# Altium project BSc_PCB_balanserande_pinne.PrjPcb
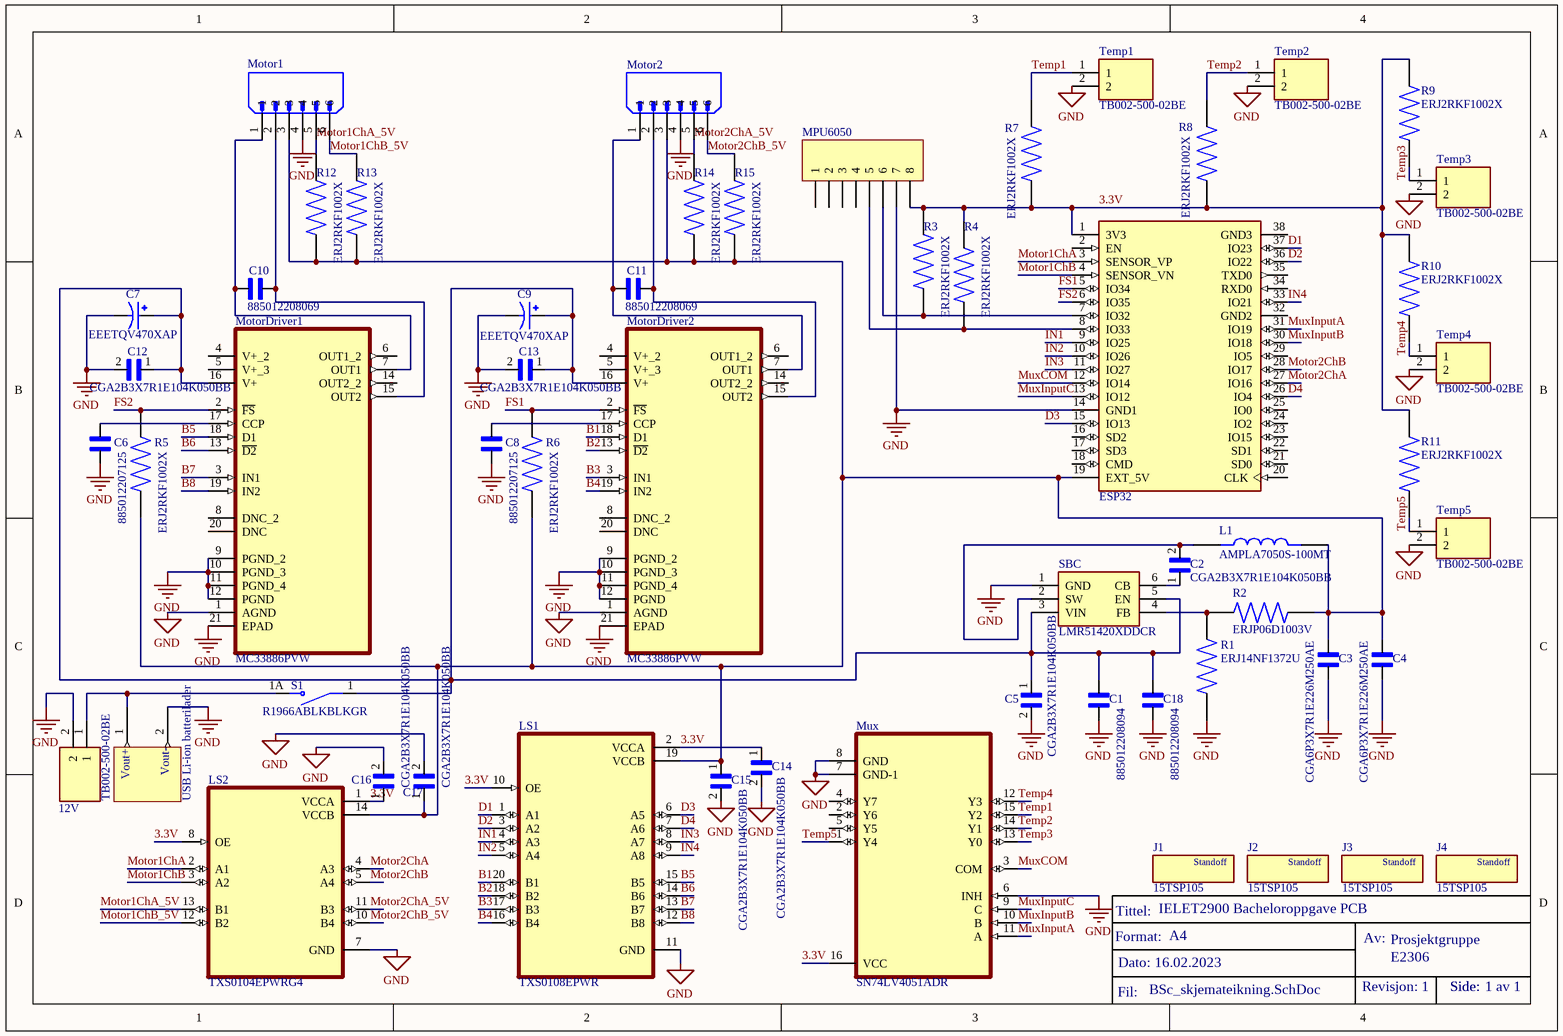
[diagram p0: BSc_skjemateikning.SchDoc]
1 sheet, 56 parts. Net scope: global (net labels, ports and power ports of the same name join across sheets).
Board file: BSc_PCB_teikning.PcbDoc

## Sheet BSc_skjemateikning.SchDoc
size A4; SheetNumber: 1; SheetTotal: 1

### Parts
12V  TB002-500-02BE  [CUI_TB002-500-02BE]
C1  885012208094  [WCAP-CSGP_885012208094]
C2  CGA2B3X7R1E104K050BB  [CAPC1005X55N]
C3  CGA6P3X7R1E226M250AE  [CAP_CGA6P3X7R1E226M250AE]
C4  CGA6P3X7R1E226M250AE  [CAP_CGA6P3X7R1E226M250AE]
C5  CGA2B3X7R1E104K050BB  [CAPC1005X55N]
C6  885012207125  [WCAP-CSGP_885012207125]
C7  EEETQV470XAP  [CAP_EEETQV470XAP]
C8  885012207125  [WCAP-CSGP_885012207125]
C9  EEETQV470XAP  [CAP_EEETQV470XAP]
C10  885012208069  [WCAP-CSGP_885012208069]
C11  885012208069  [WCAP-CSGP_885012208069]
C12  CGA2B3X7R1E104K050BB  [CAPC1005X55N]
C13  CGA2B3X7R1E104K050BB  [CAPC1005X55N]
C14  CGA2B3X7R1E104K050BB  [CAPC1005X55N]
C15  CGA2B3X7R1E104K050BB  [CAPC1005X55N]
C16  CGA2B3X7R1E104K050BB  [CAPC1005X55N]
C17  CGA2B3X7R1E104K050BB  [CAPC1005X55N]
C18  885012208094  [WCAP-CSGP_885012208094]
ESP32  ESP32-DEVKITC  [MODULE_ESP32-DEVKITC]  (value not drawn)
J1  15TSP105  [SAMTEC_SO-0715-02-01-01-L]
J2  15TSP105  [SAMTEC_SO-0715-02-01-01-L]
J3  15TSP105  [SAMTEC_SO-0715-02-01-01-L]
J4  15TSP105  [SAMTEC_SO-0715-02-01-01-L]
L1  AMPLA7050S-100MT  [IND_AMPLA7050S-100MT]
LS1  TXS0108EPWR  [SOP65P640X120-20N]
LS2  TXS0104EPWRG4  [SOP65P640X120-14N]
Motor1  (no value)  [JST_B6B-PH-K-S(LF)(SN)]
Motor2  (no value)  [JST_B6B-PH-K-S(LF)(SN)]
MotorDriver1  MC33886PVW  [SOIC127P1420X340-21N]
MotorDriver2  MC33886PVW  [SOIC127P1420X340-21N]
MPU6050  (no value)  [HDR1X8]
Mux  SN74LV4051ADR  [SOIC127P600X175-16N]
R1  ERJ14NF1372U  [RES_ERJ14NF1372U]
R2  ERJP06D1003V  [RES_ERJP06D1003V]
R3  ERJ2RKF1002X  [RES_ERJ2RKF1002X]
R4  ERJ2RKF1002X  [RES_ERJ2RKF1002X]
R5  ERJ2RKF1002X  [RES_ERJ2RKF1002X]
R6  ERJ2RKF1002X  [RES_ERJ2RKF1002X]
R7  ERJ2RKF1002X  [RES_ERJ2RKF1002X]
R8  ERJ2RKF1002X  [RES_ERJ2RKF1002X]
R9  ERJ2RKF1002X  [RES_ERJ2RKF1002X]
R10  ERJ2RKF1002X  [RES_ERJ2RKF1002X]
R11  ERJ2RKF1002X  [RES_ERJ2RKF1002X]
R12  ERJ2RKF1002X  [RES_ERJ2RKF1002X]
R13  ERJ2RKF1002X  [RES_ERJ2RKF1002X]
R14  ERJ2RKF1002X  [RES_ERJ2RKF1002X]
R15  ERJ2RKF1002X  [RES_ERJ2RKF1002X]
S1  R1966ABLKBLKGR  [SW_R1966ABLKBLKGR]
SBC  LMR51420XDDCR  [SOT95P280X110-6N]
Temp1  TB002-500-02BE  [CUI_TB002-500-02BE]
Temp2  TB002-500-02BE  [CUI_TB002-500-02BE]
Temp3  TB002-500-02BE  [CUI_TB002-500-02BE]
Temp4  TB002-500-02BE  [CUI_TB002-500-02BE]
Temp5  TB002-500-02BE  [CUI_TB002-500-02BE]
  USB Li-ion batterilader  [USB Li-ion batterilader]

### Nets
GND: 12V.2 C1.1 C3.1 C4.1 C5.2 C6.1 C7.2 C8.1 C9.2 C12.2 C13.2 C14.2 C15.2 C16.2 C17.2 C18.1 ESP32.14(GND1) LS1.11(GND) LS2.7(GND) Motor1.4 Motor2.4 MotorDriver1.1(AGND) MotorDriver1.9(PGND_2) MotorDriver1.10(PGND_3) MotorDriver1.11(PGND_4) MotorDriver1.12(PGND) MotorDriver1.21(EPAD) MotorDriver2.1(AGND) MotorDriver2.9(PGND_2) MotorDriver2.10(PGND_3) MotorDriver2.11(PGND_4) MotorDriver2.12(PGND) MotorDriver2.21(EPAD) MPU6050.7 Mux.6(INH) Mux.7(GND-1) Mux.8(GND) R1.1 SBC.1(GND) Temp1.2 Temp2.2 Temp3.2 Temp4.2 Temp5.2 .2
3.3V: C14.1 C16.1 ESP32.1(3V3) LS1.2(VCCA) LS1.10(OE) LS2.1(VCCA) LS2.8(OE) MPU6050.8 Mux.16(VCC) R3.2 R4.2 R7.2 R8.1 R9.1 R10.1 R11.1
B1: LS1.20(B1) MotorDriver2.18(D1)
B2: LS1.18(B2) MotorDriver2.13(~{D2})
B3: LS1.17(B3) MotorDriver2.3(IN1)
B4: LS1.16(B4) MotorDriver2.19(IN2)
B5: LS1.15(B5) MotorDriver1.18(D1)
B6: LS1.14(B6) MotorDriver1.13(~{D2})
B7: LS1.13(B7) MotorDriver1.3(IN1)
B8: LS1.12(B8) MotorDriver1.19(IN2)
D1: ESP32.37(IO23) LS1.1(A1)
D2: ESP32.36(IO22) LS1.3(A2)
D3: ESP32.15(IO13) LS1.6(A5)
D4: ESP32.26(IO4) LS1.7(A6)
FS1: ESP32.5(IO34) MotorDriver2.2(~{FS}) R6.1
FS2: ESP32.6(IO35) MotorDriver1.2(~{FS}) R5.2
IN1: ESP32.9(IO25) LS1.4(A3)
IN2: ESP32.10(IO26) LS1.5(A4)
IN3: ESP32.11(IO27) LS1.8(A7)
IN4: ESP32.33(IO21) LS1.9(A8)
Motor1ChA: ESP32.3(SENSOR_VP) LS2.2(A1)
Motor1ChA_5V: LS2.13(B1) Motor1.5 R12.2
Motor1ChB: ESP32.4(SENSOR_VN) LS2.3(A2)
Motor1ChB_5V: LS2.12(B2) Motor1.6 R13.2
Motor2ChA: ESP32.27(IO16) LS2.4(A3)
Motor2ChA_5V: LS2.11(B3) Motor2.5 R14.2
Motor2ChB: ESP32.28(IO17) LS2.5(A4)
Motor2ChB_5V: LS2.10(B4) Motor2.6 R15.2
MuxCOM: ESP32.12(IO14) Mux.3(COM)
MuxInputA: ESP32.31(IO19) Mux.11(A)
MuxInputB: ESP32.30(IO18) Mux.10(B)
MuxInputC: ESP32.13(IO12) Mux.9(C)
Temp1: Mux.15(Y2) R7.1 Temp1.1
Temp2: Mux.14(Y1) R8.2 Temp2.1
Temp3: Mux.13(Y0) R9.2 Temp3.1
Temp4: Mux.12(Y3) R10.2 Temp4.1
Temp5: Mux.1(Y4) R11.2 Temp5.1
Net12V_1: 12V.1 S1.1A .1
NetC1_2: C1.2 C5.1 C7.1 C9.1 C12.1 C13.1 C18.2 MotorDriver1.16(V+) MotorDriver2.16(V+) S1.1 SBC.3(VIN) SBC.5(EN)
NetC2_1: C2.1 SBC.6(CB)
NetC2_2: C2.2 L1.1 SBC.2(SW)
NetC3_2: C3.2 C4.2 C15.1 C17.1 ESP32.19(EXT_5V) L1.2 LS1.19(VCCB) LS2.14(VCCB) Motor1.3 Motor2.3 R2.1 R5.1 R6.2 R12.1 R13.1 R14.1 R15.1
NetC6_2: C6.2 MotorDriver1.17(CCP)
NetC8_2: C8.2 MotorDriver2.17(CCP)
NetC10_1: C10.1 Motor1.2 MotorDriver1.15(OUT2)
NetC10_2: C10.2 Motor1.1 MotorDriver1.7(OUT1)
NetC11_1: C11.1 Motor2.2 MotorDriver2.15(OUT2)
NetC11_2: C11.2 Motor2.1 MotorDriver2.7(OUT1)
NetESP32_7: ESP32.7(IO32) MPU6050.6 R3.1
NetESP32_8: ESP32.8(IO33) MPU6050.5 R4.1
NetR1_2: R1.2 R2.2 SBC.4(FB)

Not connected (* = marked no-connect by the designer): ESP32 2(EN) 16(SD2) 17(SD3) 18(CMD) 20(CLK) 21(SD0) 22(SD1) 23(IO15) 24(IO2) 25(IO0) 29(IO5) 32(GND2) 34(RXD0) 35(TXD0) 38(GND3); MotorDriver1 4(V+_2) 5(V+_3) 6(OUT1_2) 8(DNC_2) 14(OUT2_2) 20(DNC); MotorDriver2 4(V+_2) 5(V+_3) 6(OUT1_2) 8(DNC_2) 14(OUT2_2) 20(DNC); MPU6050 1 2 3 4; Mux 2(Y6) 4(Y7) 5(Y5)

### Notes on the sheet
- (near J1) Tittel:
- Format:
- IELET2900 Bacheloroppgave PCB
- Dato:
- Fil:
- 16.02.2023
- A4
- Revisjon: 1
- Av:
- E2306
- Prosjektgruppe
- Side:
- 1 av 1
- BSc_skjemateikning.SchDoc
- (in symbol SO-0715-02-01-01-L) Standoff
- (in symbol USB Li-ion batterilader) Vout-; Vout+

### Library data of the parts
12V Temp1-Temp5 = TB002-500-02BE: MF: {'manufacturer': u'CUI Devices'}; Package: None; MP: TB002-500-02BE; Value: *; Availability: Unavailable; Price: None
C1 C18 = 885012208094: <b> WCAP-CSGP Ceramic Capacitors <br> <br> <br><b>Characteristics </b><br> </b><br>Multilayer Ceramic Chip Capacitor <br>Recommended soldering:Reflow, for 0603 and 0805 wave soldering is also allowed <br>Operating temperature:-55 Â°C to +125 Â°C; <br>Ceramic characteristics: Class I - NPO ; Class II -X7R, X5R <br>High performance ceramic <br>High capacitance stability <br>Minimal aging  <br>Termination:Cu/Ni/Sn <br>   <br><a href="http://katalog.we-online.de/media/images/eisos/WCAP-CSGP_pf2.jpg" title="Enlarge picture"> <img src="http://katalog.we-online.de/media/thumbs2/eisos/thb_WCAP-CSGP_pf2.jpg" width="320"></a><p> Details see: <a href="http://katalog.we-online.de/en/pbs/WCAP-CSGP-1206?">http://katalog.we-online.de/en/pbs/WCAP-CSGP-1206? </a><p>Created:  2015-01-28 <br>2015 (C) Wurth Elektronik; MF: {'manufacturer': u'Wurth Electronics Inc'}; Value: *; Price: None; Availability: Unavailable; Package: None; MP: 885012208094
C2 C5 C12-C17 = CGA2B3X7R1E104K050BB: 0.1 ÂµF Â±10% 25V Ceramic Capacitor X7R 0402 (1005 Metric); MF: {'manufacturer': u'TDK Electronics'}; Price: None; Availability: Unavailable; Package: None; Value: *; MP: CGA2B3X7R1E104K050BB
C3 C4 = CGA6P3X7R1E226M250AE: MF: {'manufacturer': u'TDK Corporation'}; Price: None; Availability: Unavailable; Package: None; Value: *; MP: CGA6P3X7R1E226M250AE
C6 C8 = 885012207125: <b> WCAP-CSGP Ceramic Capacitors <br> <br> <br><b>Characteristics </b><br> </b><br>Multilayer Ceramic Chip Capacitor <br>Recommended soldering:Reflow, for 0603 and 0805 wave soldering is also allowed <br>Operating temperature:-55 Â°C to +125 Â°C; <br>Ceramic characteristics: Class I - NPO ; Class II -X7R, X5R <br>High performance ceramic <br>High capacitance stability <br>Minimal aging  <br>Termination:Cu/Ni/Sn <br>   <br><a href="http://katalog.we-online.de/media/images/eisos/WCAP-CSGP_pf2.jpg" title="Enlarge picture"> <img src="http://katalog.we-online.de/media/thumbs2/eisos/thb_WCAP-CSGP_pf2.jpg" width="320"></a><p> Details see: <a href="http://katalog.we-online.de/en/pbs/WCAP-CSGP-0805?">http://katalog.we-online.de/en/pbs/WCAP-CSGP-0805? </a><p>Created:  2015-01-28 <br>2015 (C) Wurth Elektronik; MF: {'manufacturer': u'Wurth Electronics Inc'}; MP: 885012207125; Package: None; Availability: Unavailable; Price: None; Value: *
C7 C9 = EEETQV470XAP: MF: {'manufacturer': u'Panasonic'}; MP: EEETQV470XAP; Package: None; Availability: Unavailable; Price: None; Value: *
C10 C11 = 885012208069: <b> WCAP-CSGP Ceramic Capacitors <br> <br> <br><b>Characteristics </b><br> </b><br>Multilayer Ceramic Chip Capacitor <br>Recommended soldering:Reflow, for 0603 and 0805 wave soldering is also allowed <br>Operating temperature:-55 Â°C to +125 Â°C; <br>Ceramic characteristics: Class I - NPO ; Class II -X7R, X5R <br>High performance ceramic <br>High capacitance stability <br>Minimal aging  <br>Termination:Cu/Ni/Sn <br>   <br><a href="http://katalog.we-online.de/media/images/eisos/WCAP-CSGP_pf2.jpg" title="Enlarge picture"> <img src="http://katalog.we-online.de/media/thumbs2/eisos/thb_WCAP-CSGP_pf2.jpg" width="320"></a><p> Details see: <a href="http://katalog.we-online.de/en/pbs/WCAP-CSGP-1206?">http://katalog.we-online.de/en/pbs/WCAP-CSGP-1206? </a><p>Created:  2015-01-28 <br>2015 (C) Wurth Elektronik; MF: {'manufacturer': u'Wurth Electronics Inc'}; Price: None; Package: None; Availability: Unavailable; MP: 885012208069; Value: *
ESP32 = ESP32-DEVKITC: MF: {'manufacturer': u'Olimex LTD'}; Availability: Unavailable; Price: None; Package: None; MP: ESP32-DEVKITC; Value: *
J1-J4 = SO-0715-02-01-01-L: MF: {'manufacturer': u'Samtec'}; Availability: Unavailable; Value: *; Package: None; Price: None; MP: SO-0715-02-01-01-L
L1 = AMPLA7050S-100MT: MF: {'manufacturer': u'Abracon Corporation'}; Package: None; Price: None; Availability: Unavailable; MP: AMPLA7050S-100MT; Value: *
LS1 = TXS0108EPWR: MF: {'manufacturer': u'Texas Instruments'}; Value: *; Package: None; MP: TXS0108EPWR; Price: None; Availability: Unavailable
LS2 = TXS0104EPWRG4: MF: {'manufacturer': u'Texas Instruments'}; Value: *; MP: TXS0104EPWRG4; Availability: Unavailable; Package: None; Price: None
Motor1 Motor2 = B6B-PH-K-S(LF)(SN): MF: {'manufacturer': u'JST'}; Price: None; MP: B6B-PH-K-S(LF)(SN); Availability: Unavailable; Value: *; Package: None
MotorDriver1 MotorDriver2 = MC33886PVW: H-Bridge; MF: {'manufacturer': u'NXP USA'}; Package: None; Price: None; Availability: Unavailable; MP: MC33886PVW; Value: *
MPU6050 = Header 8: Header, 8-Pin; LatestRevisionDate: 17-Jul-2002; LatestRevisionNote: Re-released for DXP Platform.; Publisher: Altium Limited
Mux = SN74LV4051ADR: MF: {'manufacturer': u'Texas Instruments'}; MP: SN74LV4051ADR; Package: None; Availability: Unavailable; Value: *; Price: None
R1 = ERJ14NF1372U: MF: {'manufacturer': u'Panasonic'}; Package: None; Price: None; Availability: Unavailable; MP: ERJ14NF1372U; Value: *
R2 = ERJP06D1003V: MF: {'manufacturer': u'Panasonic'}; Price: None; Availability: Unavailable; Package: None; Value: *; MP: ERJP06D1003V
R3-R15 = ERJ2RKF1002X: MF: {'manufacturer': u'Panasonic'}; Package: None; MP: ERJ2RKF1002X; Value: *; Availability: Unavailable; Price: None
S1 = R1966ABLKBLKGR: MF: {'manufacturer': u'E-Switch'}; MP: R1966ABLKBLKGR; Availability: Unavailable; Value: *; Price: None; Package: None
SBC = LMR51420XDDCR: Integrated Circuit; Manufacturer_Name: Texas Instruments; Datasheet Link: https://www.ti.com/lit/ds/symlink/lmr51420.pdf?ts=1663231243064; Height: 1.1mm; Manufacturer_Part_Number: LMR51420XDDCR; Mouser Part Number: 595-LMR51420XDDCR; Mouser Price/Stock: https://www.mouser.co.uk/ProductDetail/Texas-Instruments/LMR51420XDDCR?qs=vvQtp7zwQdN6fBqQU4azxw%3D%3D; Arrow Part Number: LMR51420XDDCR; Arrow Price/Stock: https://www.arrow.com/en/products/lmr51420xddcr/texas-instruments?region=nac